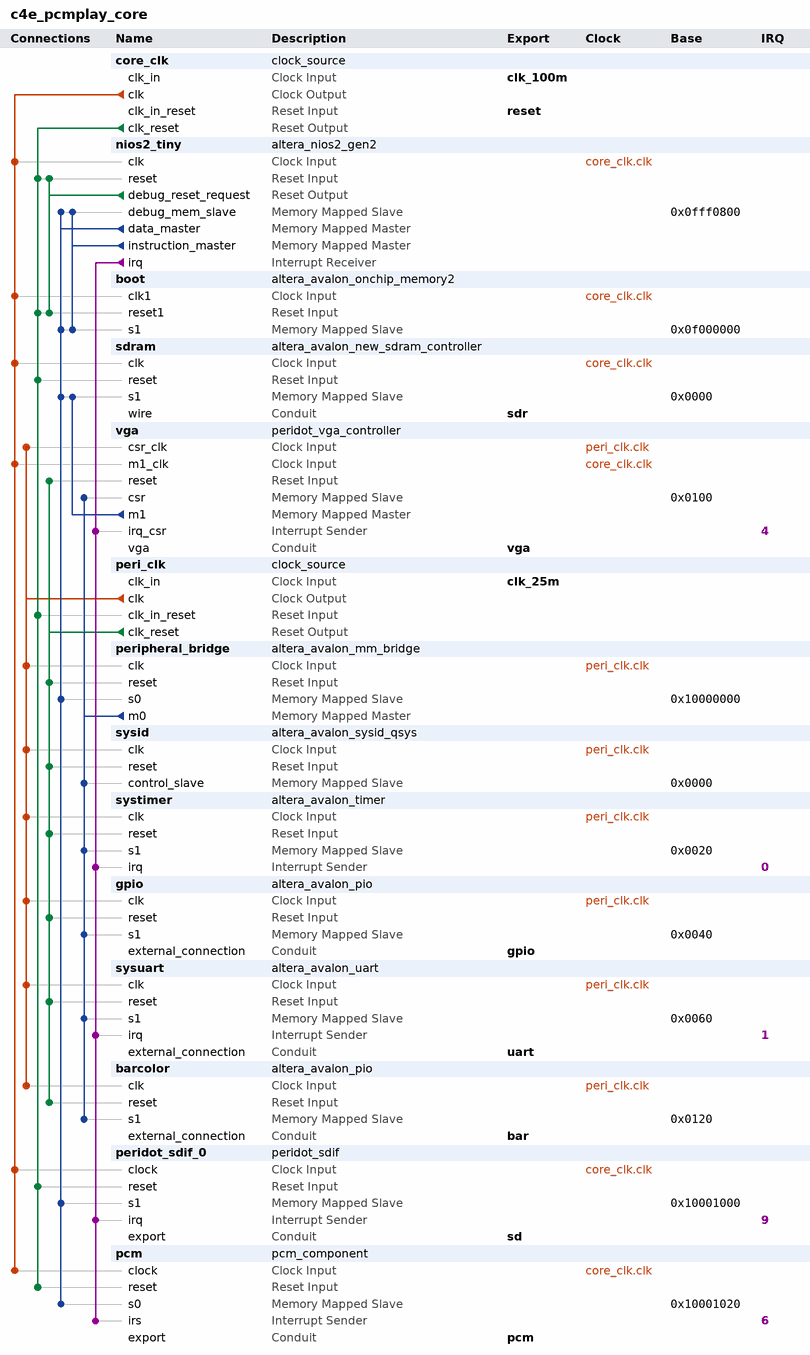
[diagram p0: system contents]
# Platform Designer (Qsys) system c4e_pcmplay_core, Cyclone IV E EP4CE6E22C8
# Parameters at their usual value, and those the tool derives, are not listed.
package require -exact qsys 20.1
create_system c4e_pcmplay_core
set_project_property DEVICE_FAMILY {Cyclone IV E}
set_project_property DEVICE EP4CE6E22C8

add_instance core_clk clock_source 20.1
set_instance_parameter_value core_clk clockFrequency 100000000

add_instance nios2_tiny altera_nios2_gen2 20.1
set_instance_parameter_value nios2_tiny dcache_size 0
set_instance_parameter_value nios2_tiny exceptionSlave boot.s1
set_instance_parameter_value nios2_tiny icache_size 4096
set_instance_parameter_value nios2_tiny impl Tiny
set_instance_parameter_value nios2_tiny mul_64_impl 1
set_instance_parameter_value nios2_tiny resetSlave boot.s1
set_instance_parameter_value nios2_tiny setting_branchpredictiontype Static
set_instance_parameter_value nios2_tiny setting_shadowRegisterSets 7
set_instance_parameter_value nios2_tiny shift_rot_impl 0

add_instance boot altera_avalon_onchip_memory2 20.1
set_instance_parameter_value boot dataWidth 32
set_instance_parameter_value boot dualPort false
set_instance_parameter_value boot initMemContent true
set_instance_parameter_value boot initializationFileName boot.hex
set_instance_parameter_value boot memorySize 16384
set_instance_parameter_value boot useNonDefaultInitFile true

add_instance sdram altera_avalon_new_sdram_controller 20.1
set_instance_parameter_value sdram TAC 6.0
set_instance_parameter_value sdram TRCD 21.0
set_instance_parameter_value sdram TRFC 63.0
set_instance_parameter_value sdram TRP 21.0
set_instance_parameter_value sdram casLatency 2
set_instance_parameter_value sdram columnWidth 9
set_instance_parameter_value sdram dataWidth 16
set_instance_parameter_value sdram generateSimulationModel false
set_instance_parameter_value sdram model single_Micron_MT48LC4M32B2_7_chip
set_instance_parameter_value sdram numberOfBanks 4
set_instance_parameter_value sdram numberOfChipSelects 1
set_instance_parameter_value sdram powerUpDelay 200.0
set_instance_parameter_value sdram refreshPeriod 7.8125
set_instance_parameter_value sdram rowWidth 13

add_instance vga peridot_vga_controller 20.0.99
set_instance_parameter_value vga AVM_CLOCKFREQ 100000000
set_instance_parameter_value vga BURSTCOUNT_WIDTH 8
set_instance_parameter_value vga CSR_CLOCKFREQ 25000000
set_instance_parameter_value vga DOTCLOCK_FREQUENCY 74.25
set_instance_parameter_value vga INTERFACE_MODE PARALLEL
set_instance_parameter_value vga LINEOFFSETBYTES 2560
set_instance_parameter_value vga PART_NAME EP4CE6E22C8
set_instance_parameter_value vga PCMSAMPLE_FREQUENCY 44100
set_instance_parameter_value vga PIXEL_COLORORDER RGB565
set_instance_parameter_value vga PIXEL_DATAORDER BYTE
set_instance_parameter_value vga PIXEL_QUEUE 1
set_instance_parameter_value vga SUPPORT_AUDIOSTREAM 0
set_instance_parameter_value vga SUPPORT_RESOLUTION 7
set_instance_parameter_value vga VIDEO_HACTIVE 480
set_instance_parameter_value vga VIDEO_HBACKP 0
set_instance_parameter_value vga VIDEO_HSYNC 40
set_instance_parameter_value vga VIDEO_HTOTAL 525
set_instance_parameter_value vga VIDEO_VACTIVE 272
set_instance_parameter_value vga VIDEO_VBACKP 0
set_instance_parameter_value vga VIDEO_VSYNC 3
set_instance_parameter_value vga VIDEO_VTOTAL 288

add_instance peri_clk clock_source 20.1
set_instance_parameter_value peri_clk clockFrequency 25000000

add_instance peripheral_bridge altera_avalon_mm_bridge 20.1
set_instance_parameter_value peripheral_bridge ADDRESS_UNITS SYMBOLS
set_instance_parameter_value peripheral_bridge ADDRESS_WIDTH 9
set_instance_parameter_value peripheral_bridge DATA_WIDTH 32
set_instance_parameter_value peripheral_bridge MAX_PENDING_RESPONSES 1
set_instance_parameter_value peripheral_bridge USE_AUTO_ADDRESS_WIDTH 0

add_instance sysid altera_avalon_sysid_qsys 20.1
set_instance_parameter_value sysid id -1608318703

add_instance systimer altera_avalon_timer 20.1
set_instance_parameter_value systimer period 1
set_instance_parameter_value systimer periodUnits MSEC

add_instance gpio altera_avalon_pio 20.1
set_instance_parameter_value gpio direction Bidir
set_instance_parameter_value gpio width 2

add_instance sysuart altera_avalon_uart 20.1
set_instance_parameter_value sysuart baud 115200
set_instance_parameter_value sysuart dataBits 8
set_instance_parameter_value sysuart fixedBaud true
set_instance_parameter_value sysuart parity NONE
set_instance_parameter_value sysuart stopBits 1

add_instance barcolor altera_avalon_pio 20.1
set_instance_parameter_value barcolor direction Output
set_instance_parameter_value barcolor width 12

add_instance peridot_sdif_0 peridot_sdif 19.1
set_instance_parameter_value peridot_sdif_0 CLOCKFREQ 100000000

add_instance pcm pcm_component 1.0

# connections
add_connection core_clk.clk boot.clk1 clock
add_connection core_clk.clk nios2_tiny.clk clock
add_connection core_clk.clk pcm.clock clock
add_connection core_clk.clk peridot_sdif_0.clock clock
add_connection core_clk.clk sdram.clk clock
add_connection core_clk.clk vga.m1_clk clock
add_connection peri_clk.clk barcolor.clk clock
add_connection peri_clk.clk gpio.clk clock
add_connection peri_clk.clk peripheral_bridge.clk clock
add_connection peri_clk.clk sysid.clk clock
add_connection peri_clk.clk systimer.clk clock
add_connection peri_clk.clk sysuart.clk clock
add_connection peri_clk.clk vga.csr_clk clock
add_connection core_clk.clk_reset boot.reset1 reset
add_connection core_clk.clk_reset nios2_tiny.reset reset
add_connection core_clk.clk_reset pcm.reset reset
add_connection core_clk.clk_reset peri_clk.clk_in_reset reset
add_connection core_clk.clk_reset peridot_sdif_0.reset reset
add_connection core_clk.clk_reset sdram.reset reset
add_connection nios2_tiny.debug_reset_request boot.reset1 reset
add_connection nios2_tiny.debug_reset_request nios2_tiny.reset reset
add_connection peri_clk.clk_reset barcolor.reset reset
add_connection peri_clk.clk_reset gpio.reset reset
add_connection peri_clk.clk_reset peripheral_bridge.reset reset
add_connection peri_clk.clk_reset sysid.reset reset
add_connection peri_clk.clk_reset systimer.reset reset
add_connection peri_clk.clk_reset sysuart.reset reset
add_connection peri_clk.clk_reset vga.reset reset
add_connection nios2_tiny.data_master boot.s1 avalon
set_connection_parameter_value nios2_tiny.data_master/boot.s1 baseAddress 0x0f000000
add_connection nios2_tiny.data_master nios2_tiny.debug_mem_slave avalon
set_connection_parameter_value nios2_tiny.data_master/nios2_tiny.debug_mem_slave baseAddress 0x0fff0800
add_connection nios2_tiny.data_master pcm.s0 avalon
set_connection_parameter_value nios2_tiny.data_master/pcm.s0 baseAddress 0x10001020
add_connection nios2_tiny.data_master peridot_sdif_0.s1 avalon
set_connection_parameter_value nios2_tiny.data_master/peridot_sdif_0.s1 baseAddress 0x10001000
add_connection nios2_tiny.data_master peripheral_bridge.s0 avalon
set_connection_parameter_value nios2_tiny.data_master/peripheral_bridge.s0 baseAddress 0x10000000
add_connection nios2_tiny.data_master sdram.s1 avalon
set_connection_parameter_value nios2_tiny.data_master/sdram.s1 baseAddress 0x0000
add_connection nios2_tiny.instruction_master boot.s1 avalon
set_connection_parameter_value nios2_tiny.instruction_master/boot.s1 baseAddress 0x0f000000
add_connection nios2_tiny.instruction_master nios2_tiny.debug_mem_slave avalon
set_connection_parameter_value nios2_tiny.instruction_master/nios2_tiny.debug_mem_slave baseAddress 0x0fff0800
add_connection peripheral_bridge.m0 barcolor.s1 avalon
set_connection_parameter_value peripheral_bridge.m0/barcolor.s1 baseAddress 0x0120
add_connection peripheral_bridge.m0 gpio.s1 avalon
set_connection_parameter_value peripheral_bridge.m0/gpio.s1 baseAddress 0x0040
add_connection peripheral_bridge.m0 sysid.control_slave avalon
set_connection_parameter_value peripheral_bridge.m0/sysid.control_slave baseAddress 0x0000
add_connection peripheral_bridge.m0 systimer.s1 avalon
set_connection_parameter_value peripheral_bridge.m0/systimer.s1 baseAddress 0x0020
add_connection peripheral_bridge.m0 sysuart.s1 avalon
set_connection_parameter_value peripheral_bridge.m0/sysuart.s1 baseAddress 0x0060
add_connection peripheral_bridge.m0 vga.csr avalon
set_connection_parameter_value peripheral_bridge.m0/vga.csr baseAddress 0x0100
add_connection vga.m1 sdram.s1 avalon
set_connection_parameter_value vga.m1/sdram.s1 baseAddress 0x0000
add_connection nios2_tiny.irq pcm.irs interrupt
set_connection_parameter_value nios2_tiny.irq/pcm.irs irqNumber 6
add_connection nios2_tiny.irq peridot_sdif_0.irq interrupt
set_connection_parameter_value nios2_tiny.irq/peridot_sdif_0.irq irqNumber 9
add_connection nios2_tiny.irq systimer.irq interrupt
set_connection_parameter_value nios2_tiny.irq/systimer.irq irqNumber 0
add_connection nios2_tiny.irq sysuart.irq interrupt
set_connection_parameter_value nios2_tiny.irq/sysuart.irq irqNumber 1
add_connection nios2_tiny.irq vga.irq_csr interrupt
set_connection_parameter_value nios2_tiny.irq/vga.irq_csr irqNumber 4

# exported interfaces
add_interface bar conduit end
set_interface_property bar EXPORT_OF barcolor.external_connection
add_interface clk_100m clock sink
set_interface_property clk_100m EXPORT_OF core_clk.clk_in
add_interface clk_25m clock sink
set_interface_property clk_25m EXPORT_OF peri_clk.clk_in
add_interface gpio conduit end
set_interface_property gpio EXPORT_OF gpio.external_connection
add_interface pcm conduit end
set_interface_property pcm EXPORT_OF pcm.export
add_interface reset reset sink
set_interface_property reset EXPORT_OF core_clk.clk_in_reset
add_interface sd conduit end
set_interface_property sd EXPORT_OF peridot_sdif_0.export
add_interface sdr conduit end
set_interface_property sdr EXPORT_OF sdram.wire
add_interface uart conduit end
set_interface_property uart EXPORT_OF sysuart.external_connection
add_interface vga conduit end
set_interface_property vga EXPORT_OF vga.vga

set_interconnect_requirement {$system} qsys_mm.clockCrossingAdapter HANDSHAKE
set_interconnect_requirement {$system} qsys_mm.enableEccProtection FALSE
set_interconnect_requirement {$system} qsys_mm.insertDefaultSlave FALSE
set_interconnect_requirement {$system} qsys_mm.maxAdditionalLatency 1

save_system c4e_pcmplay_core.qsys
